# Altium schematic sheet Adapter.SchDoc
size A
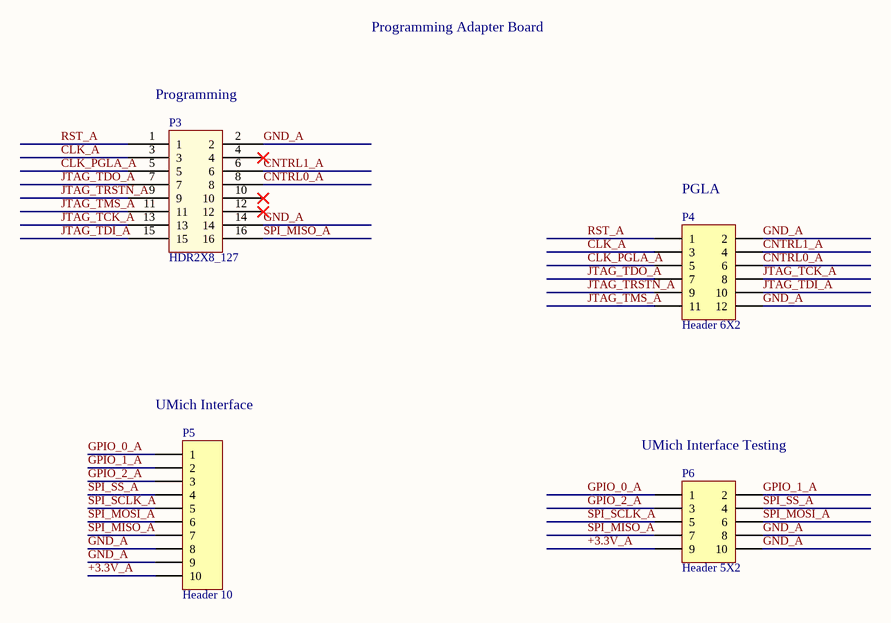
[diagram p0: Adapter.SchDoc]

## Parts
P3  HDR2X8_127  [HDR2X8_127]
P4  Header 6X2  [HDR2X6]
P5  Header 10  [505110-1092]
P6  Header 5X2  [HDR2X5]

## Nets
+3.3V_A: P5.10 P6.9
CLK_A: P3.3 P4.3
CLK_PGLA_A: P3.5 P4.5
CNTRL0_A: P3.8 P4.6
CNTRL1_A: P3.6 P4.4
GND_A: P3.2 P3.14 P4.2 P4.12 P5.8 P5.9 P6.8 P6.10
GPIO_0_A: P5.1 P6.1
GPIO_1_A: P5.2 P6.2
GPIO_2_A: P5.3 P6.3
JTAG_TCK_A: P3.13 P4.8
JTAG_TDI_A: P3.15 P4.10
JTAG_TDO_A: P3.7 P4.7
JTAG_TMS_A: P3.11 P4.11
JTAG_TRSTN_A: P3.9 P4.9
RST_A: P3.1 P4.1
SPI_MISO_A: P3.16 P5.7 P6.7
SPI_MOSI_A: P5.6 P6.6
SPI_SCLK_A: P5.5 P6.5
SPI_SS_A: P5.4 P6.4

Not connected (* = marked no-connect by the designer): P3 4* 10* 12*

## Notes on the sheet
- Programming Adapter Board
- (near P3) Programming
- (near P4) PGLA
- (near P5) UMich Interface
- (near P6) UMich Interface Testing

## Library data of the parts
P3 = HDR2X8_127: Header 16 positions 1.27mm
P4 = Header 6X2: Header, 6-Pin, Dual row; LatestRevisionDate: 17-Jul-2002; LatestRevisionNote: Re-released for DXP Platform.; Publisher: Altium Limited
P5 = Header 10: Header, 10-Pin; LatestRevisionDate: 17-Jul-2002; LatestRevisionNote: Re-released for DXP Platform.; Publisher: Altium Limited
P6 = Header 5X2: Header, 5-Pin, Dual row; LatestRevisionDate: 17-Jul-2002; LatestRevisionNote: Re-released for DXP Platform.; Publisher: Altium Limited